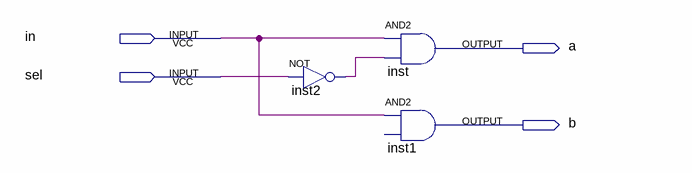
[diagram p0: schematic sheet]
// Quartus schematic DMux.bdf as structural Verilog: 3 symbols, 4 pins
module DMux (
  input  in,
  input  sel,
  output a,
  output b
);

  wire inst2_out;

  not inst2 (inst2_out, sel);
  and inst (a, in, inst2_out);
  buf inst1 (b, in);  // AND2 open: IN2
endmodule
